# Altium schematic sheet MAIN.SchDoc
size A4; SheetNumber: 3; SheetTotal: 3
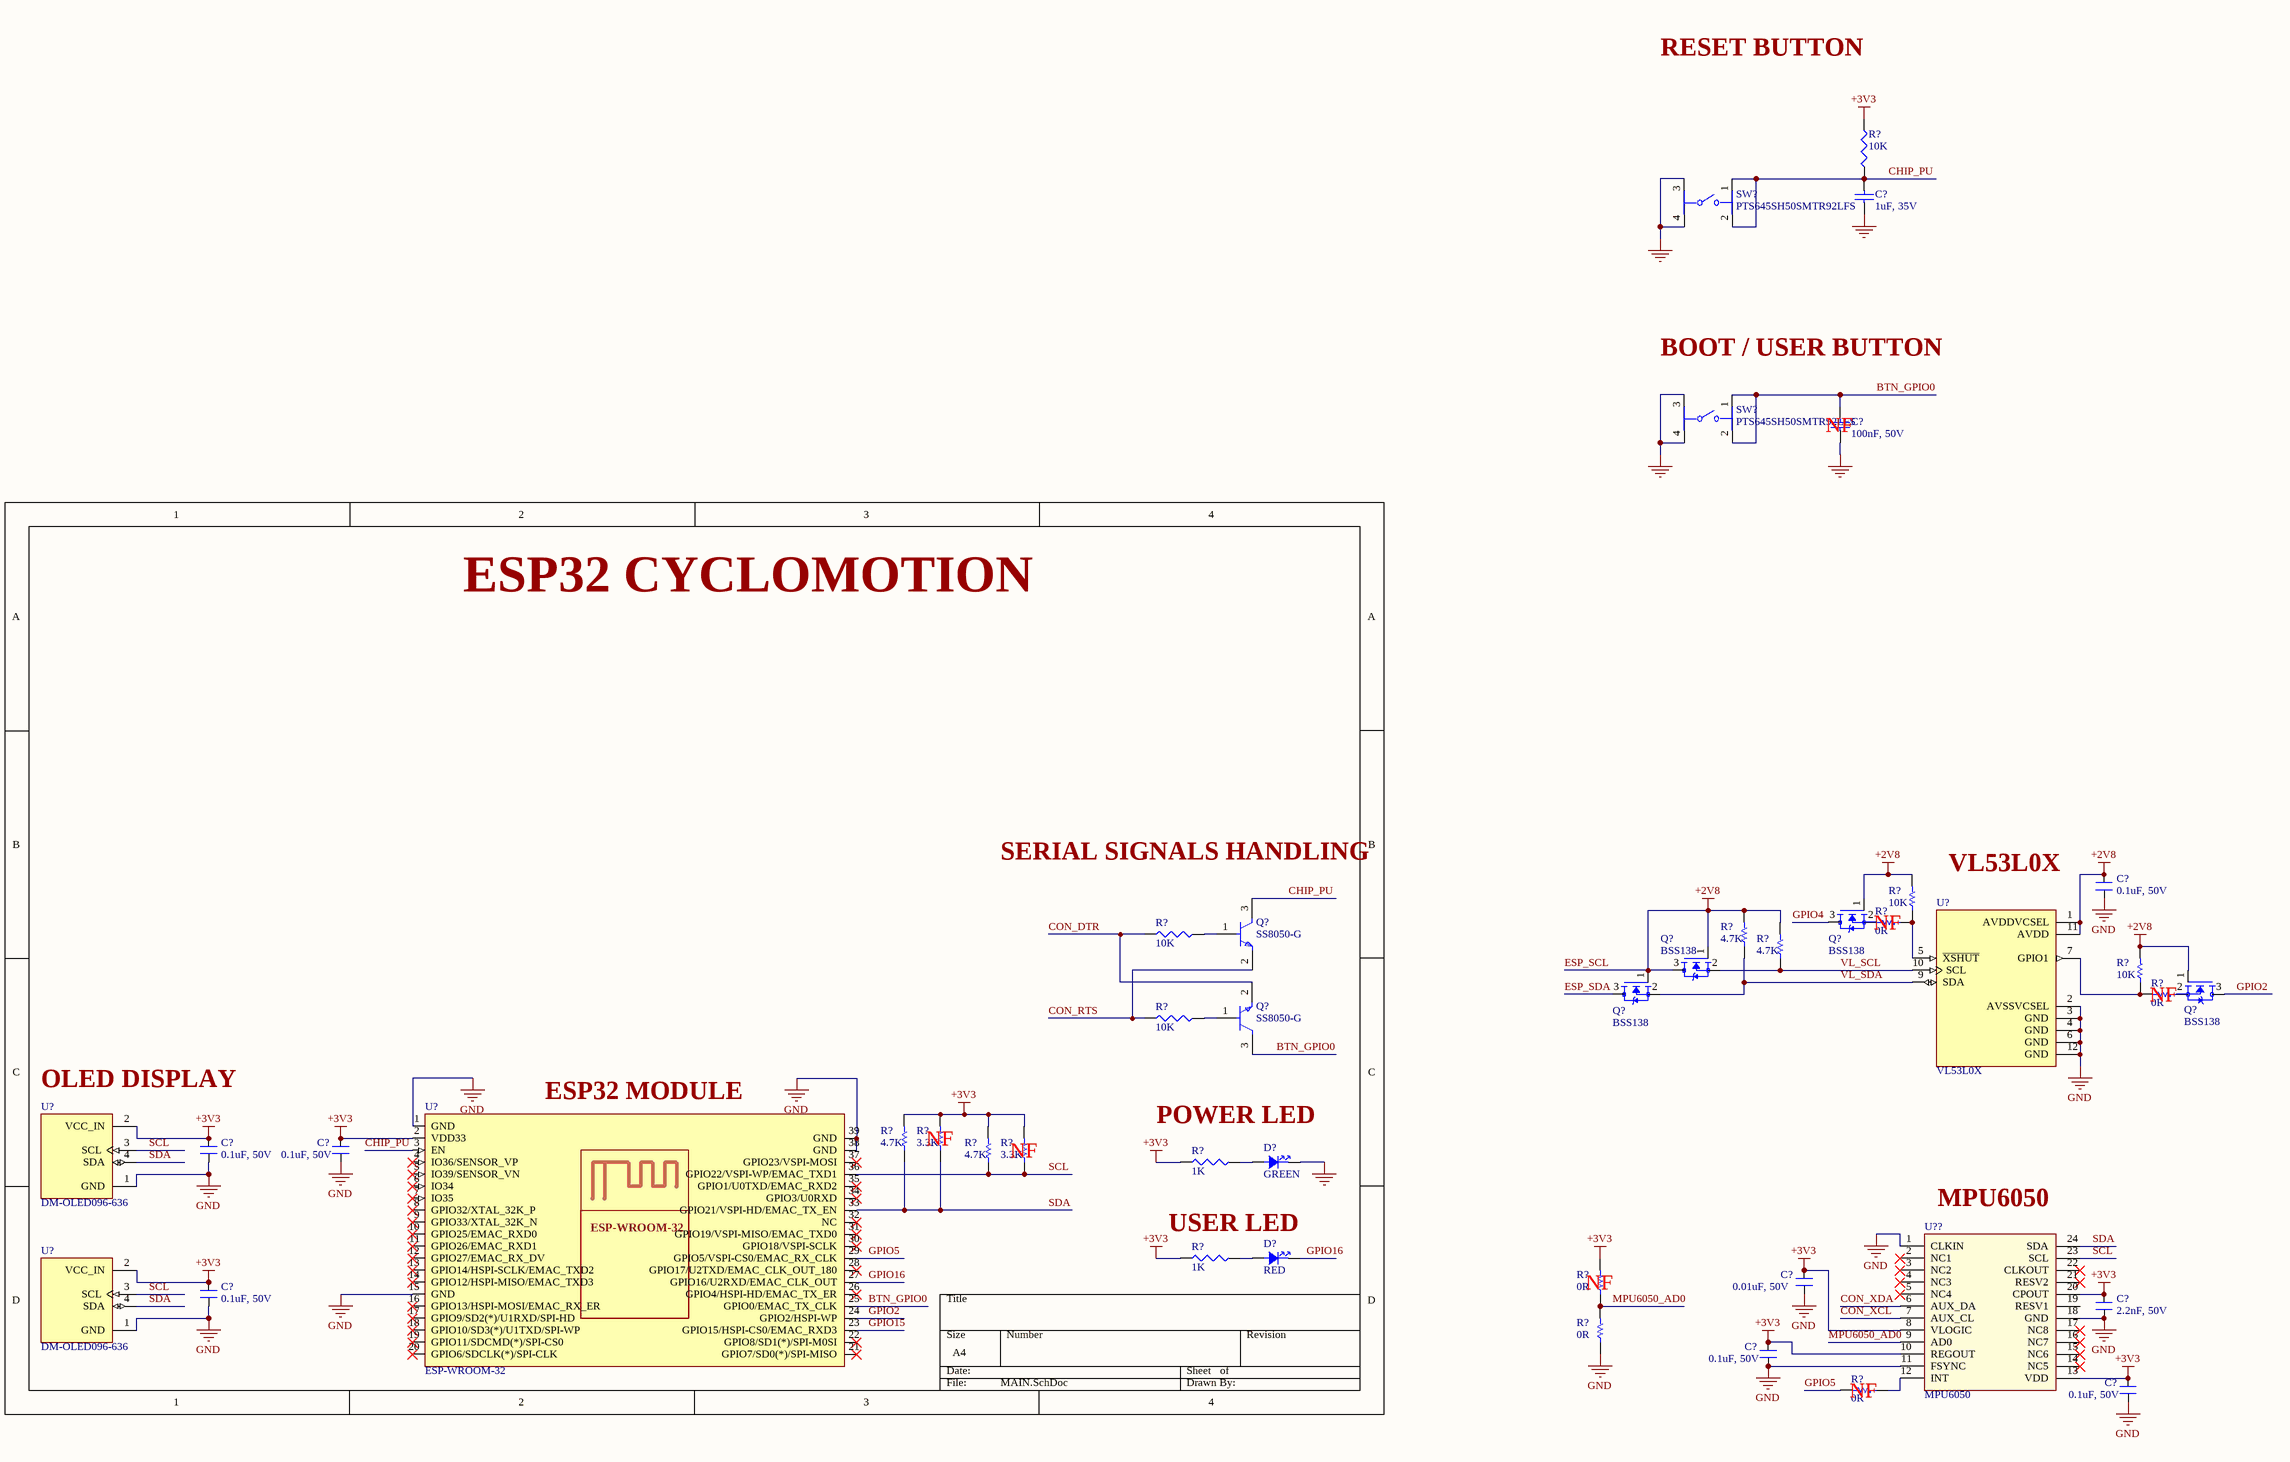
[diagram p0: MAIN.SchDoc]

## Parts
(Parts that share a designator on the sheet are numbered #1, #2 ... from top to bottom, then left to right.)
C?#1  1uF, 35V  [CAPC1005X55N]
C?#2  100nF, 50V  [CAPC1005X55N]
C?#3  0.1uF, 50V  [CAP_CERA_C2012(CC0805INCH)]
C?#4  0.1uF, 50V  [CAP_CERA_C2012(CC0805INCH)]
C?#5  0.1uF, 50V  [CAP_CERA_C2012(CC0805INCH)]
C?#6  0.01uF, 50V  [CAP_CERA_C2012(CC0805INCH)]
C?#7  0.1uF, 50V  [CAP_CERA_C2012(CC0805INCH)]
C?#8  2.2nF, 50V  [CAP_CERA_C2012(CC0805INCH)]
C?#9  0.1uF, 50V  [CAP_CERA_C2012(CC0805INCH)]
C?#10  0.1uF, 50V  [CAP_CERA_C2012(CC0805INCH)]
D?#1  GREEN  [LED0402G]
D?#2  RED  [LED0402R]
Q?#1  BSS138  [SOT95P240X111-3N]
Q?#2  SS8050-G  [FP-SS8050-G-IPC_B]
Q?#3  BSS138  [SOT95P240X111-3N]
Q?#4  BSS138  [SOT95P240X111-3N]
Q?#5  BSS138  [SOT95P240X111-3N]
Q?#6  SS8050-G  [FP-SS8050-G-IPC_B]
R?#1  10K  [RESC1005X37N]
R?#2  10K  [Res 1206 SMD]
R?#3  0R  [Res 1206 SMD]
R?#4  10K  [RESC1005X37N]
R?#5  4.7K  [Res 1206 SMD]
R?#6  4.7K  [Res 1206 SMD]
R?#7  10K  [Res 1206 SMD]
R?#8  0R  [Res 1206 SMD]
R?#9  10K  [RESC1005X37N]
R?#10  4.7K  [Res 1206 SMD]
R?#11  3.3K  [Res 1206 SMD]
R?#12  1K  [RESC1005X37N]
R?#13  4.7K  [Res 1206 SMD]
R?#14  3.3K  [Res 1206 SMD]
R?#15  1K  [RESC1005X37N]
R?#16  0R  [Res 1206 SMD]
R?#17  0R  [Res 1206 SMD]
R?#18  0R  [Res 1206 SMD]
SW?#1  PTS645SH50SMTR92LFS  [FP-PTS645SH50SMTR92LFS-MFG]
SW?#2  PTS645SH50SMTR92LFS  [FP-PTS645SH50SMTR92LFS-MFG]
U?#1  VL53L0X  [SENSOR_VL53L0X]
U?#2  ESP-WROOM-32  [ESP32 WROOM]
U?#3  DM-OLED096-636  [MODULE_DM-OLED096-636]
U?#4  DM-OLED096-636  [MODULE_DM-OLED096-636]
U??  MPU6050  [14# MPU -6050]

## Nets
+3V3: C?#4.1 C?#5.1 C?#6.1 C?#7.1 C?#8.1 C?#9.1 C?#10.1 R?#1.2 R?#10.2 R?#11.2 R?#12.2 R?#13.2 R?#14.2 R?#15.2 R?#16.2 U?#2.2(VDD33) U?#3.2(VCC_IN) U?#4.2(VCC_IN) U??.8(VLOGIC) U??.10(REGOUT) U??.13(VDD) U??.20(CPOUT)
ESP_SCL: C?#3.1 Q?#1.1(G) Q?#3.1(G) Q?#3.3(D) Q?#4.1(G) Q?#5.1(G) R?#2.2 R?#5.2 R?#6.2 R?#7.2 U?#1.1(AVDDVCSEL) U?#1.11(AVDD)  [also labelled +2V8]
GND: C?#1.1 C?#2.1 C?#3.2 C?#4.2 C?#5.2 C?#6.2 C?#7.2 C?#8.2 C?#9.2 C?#10.2 D?#1.1 R?#17.1 SW?#1.3 SW?#1.4 SW?#2.3 SW?#2.4 U?#1.2(AVSSVCSEL) U?#1.3(GND) U?#1.4(GND) U?#1.6(GND) U?#1.12(GND) U?#2.1(GND) U?#2.15(GND) U?#2.38(GND) U?#2.39(GND) U?#3.1(GND) U?#4.1(GND) U??.1(CLKIN) U??.11(FSYNC) U??.18(GND)
BTN_GPIO0: C?#2.2 Q?#6.3(C) SW?#2.1 SW?#2.2 U?#2.25(GPIO0/EMAC_TX_CLK)
CHIP_PU: C?#1.2 Q?#2.3(C) R?#1.1 SW?#1.1 SW?#1.2 U?#2.3(EN)
CON_DTR: Q?#6.2(E) R?#4.1
CON_RTS: Q?#2.2(E) R?#9.1
CON_XCL: U??.7(AUX_CL)
CON_XDA: U??.6(AUX_DA)
ESP_SDA: Q?#4.3(D)
GPIO2: Q?#5.3(D) U?#2.24(GPIO2/HSPI-WP)
GPIO4: Q?#1.3(D)
GPIO5: R?#18.2 U?#2.29(GPIO5/VSPI-CS0/EMAC_RX_CLK)
GPIO15: U?#2.23(GPIO15/HSPI-CS0/EMAC_RXD3)
GPIO16: D?#2.1 U?#2.27(GPIO16/U2RXD/EMAC_CLK_OUT)
MPU6050_AD0: R?#16.1 R?#17.2 U??.9(AD0)
SCL: R?#13.1 R?#14.1 U?#2.36(GPIO22/VSPI-WP/EMAC_TXD1) U?#3.3(SCL) U?#4.3(SCL) U??.23(SCL)
SDA: R?#10.1 R?#11.1 U?#2.33(GPIO21/VSPI-HD/EMAC_TX_EN) U?#3.4(SDA) U?#4.4(SDA) U??.24(SDA)
VL_SCL: Q?#3.2(S) R?#6.1 U?#1.10(SCL)
VL_SDA: Q?#4.2(S) R?#5.1 U?#1.9(SDA)
NetD?#1_2: D?#1.2 R?#12.1
NetD?#2_2: D?#2.2 R?#15.1
NetQ?#1_2: Q?#1.2(S) R?#3.2
NetQ?#2_1: Q?#2.1(B) R?#4.2
NetQ?#5_2: Q?#5.2(S) R?#8.1
NetQ?#6_1: Q?#6.1(B) R?#9.2
NetR?#2_1: R?#2.1 R?#3.1 U?#1.5(~{XSHUT})
NetR?#7_1: R?#7.1 R?#8.2 U?#1.7(GPIO1)
NetR?#18_1: R?#18.1 U??.12(INT)

Not connected (* = marked no-connect by the designer): U?#2 4(IO36/SENSOR_VP)* 5(IO39/SENSOR_VN)* 6(IO34)* 7(IO35)* 8(GPIO32/XTAL_32K_P)* 9(GPIO33/XTAL_32K_N)* 10(GPIO25/EMAC_RXD0)* 11(GPIO26/EMAC_RXD1)* 12(GPIO27/EMAC_RX_DV)* 13(GPIO14/HSPI-SCLK/EMAC_TXD2)* 14(GPIO12/HSPI-MISO/EMAC_TXD3)* 16(GPIO13/HSPI-MOSI/EMAC_RX_ER)* 17(GPIO9/SD2(*)/U1RXD/SPI-HD)* 18(GPIO10/SD3(*)/U1TXD/SPI-WP)* 19(GPIO11/SDCMD(*)/SPI-CS0)* 20(GPIO6/SDCLK(*)/SPI-CLK)* 21(GPIO7/SD0(*)/SPI-MISO)* 22(GPIO8/SD1(*)/SPI-M0SI)* 26(GPIO4/HSPI-HD/EMAC_TX_ER)* 28(GPIO17/U2TXD/EMAC_CLK_OUT_180)* 30(GPIO18/VSPI-SCLK)* 31(GPIO19/VSPI-MISO/EMAC_TXD0)* 32(NC)* 34(GPIO3/U0RXD)* 35(GPIO1/U0TXD/EMAC_RXD2)* 37(GPIO23/VSPI-MOSI)*; U?? 2(NC1)* 3(NC2)* 4(NC3)* 5(NC4)* 14(NC5)* 15(NC6)* 16(NC7)* 17(NC8)* 19(RESV1) 21(RESV2)* 22(CLKOUT)*

## Notes on the sheet
- RESET BUTTON
- BOOT / USER BUTTON
- (near C?#2) NF
- ESP32 CYCLOMOTION
- SERIAL SIGNALS HANDLING
- VL53L0X
- (near R?#3) NF
- (near R?#8) NF
- (near U?#3) OLED DISPLAY
- (near U?#2) ESP32 MODULE
- (near R?#11) NF
- POWER LED
- (near R?#14) NF
- (near U??) MPU6050
- USER LED
- (near R?#16) NF
- (near R?#18) NF

## Library data of the parts
C?#1 = CL05A105KL5NRNC: CAP CER 1UF 35V X5R 0402; Manufacturer: Samsung; Dielectric Material: Ceramic; Multilayer: Yes; Tolerance  (fill in as +-): 10%; Supplier: Digikey; Supplier Part Number: 1276-6796-1-ND; Manufacturer Part Number: CL05A105KL5NRNC; RoHS: Yes; Category: Ceramic Capacitors; Stock: 469958; Pricing: 1=0.33, 10=0.212, 50=0.149, 100=0.1202, 500=0.08934, 1000=0.07818, 2500=0.07446, 5000=0.06887 (USD); Mounting Technology: Surface Mount; Pins: 2; Package Shape: Rectangular; Case/Package: 0402; Terminal Finish: Nickel; Min Operating Temperature: -55°C; Max Operating Temperature: 85°C; JESD-609 Code: e3; Value: 1uF; Capacitor Type: Ceramic; Packaging: Tape and Reel; Tolerance (fill in as +-): 10%; Rated DC Voltage (URdc): 35V; Temperature Characteristics Code: X5R; Termination: Wraparound; Reach SVHC Compliant: Yes; RoHS Compliant: Yes; ComponentLink1URL: https://datasheet.ciiva.com:443/pdfs/VipMasterIC/IC/SEMS/SEMS-S-A0008384515/SEMS-S-A0008872905-1.pdf?src-supplier=IHS+Markit; ComponentLink1Description: https://datasheet.ciiva.com:443/pdfs/VipMasterIC/IC/SEMS/SEMS-S-A0008384515/SEMS-S-A0008872905-1.pdf?src-supplier=IHS+Markit; ComponentLink2URL: http://www.samsungsem.com/kr/support/product-search/mlcc/CL05A105KL5NRNC.jsp?src-supplier=Digikey; ComponentLink2Description: http://www.samsungsem.com/kr/support/product-search/mlcc/CL05A105KL5NRNC.jsp?src-supplier=Digikey; LCSC Part Number: C307413
C?#2 = CL05B104KB54PNC: CAP CER 0.1UF 50V X7R 0402; Manufacturer: Samsung; Dielectric Material: Ceramic; Supplier: Digikey; Supplier Part Number: 1276-CL05B104KB54PNCCT-ND; Manufacturer Part Number: CL05B104KB54PNC; RoHS: Yes; Category: Ceramic Capacitors; Stock: 1237875; Pricing: 1=0.1, 10=0.044, 50=0.025, 100=0.0194, 500=0.0146, 1000=0.01147, 2500=0.01043, 5000=0.00959 (USD); Pins: 2; Capacitor Type: Ceramic; RoHS Compliant: Yes; Reach SVHC Compliant: Yes; ComponentLink1URL: https://datasheet.ciiva.com:443/pdfs/VipMasterIC/IC/SEMS/SEMS-S-A0006318249/SEMS-S-A0006320959-1.pdf?src-supplier=IHS+Markit; ComponentLink1Description: https://datasheet.ciiva.com:443/pdfs/VipMasterIC/IC/SEMS/SEMS-S-A0006318249/SEMS-S-A0006320959-1.pdf?src-supplier=IHS+Markit; ComponentLink2URL: https://datasheet.octopart.com/CL05B104KB54PNC-Samsung-datasheet-8326407.pdf?src-supplier=TME; ComponentLink2Description: https://datasheet.octopart.com/CL05B104KB54PNC-Samsung-datasheet-8326407.pdf?src-supplier=TME; LCSC Part Number: C307331
C?#3-C?#10 = CAP CERA 0805: CERAMIC CAP 0805; Value: 100pF, 2012
D?#1 = VLMG1500-GS08: LED YLW-GRN 0402 SMD; Manufacturer: Vishay; Color: Green,Yellow; Lens Color: Clear; Viewing Angle: 130°; Forward Current: 30mA; Forward Voltage: 2V; Luminous Intensity: 35mcd; Dominant Wavelength: 571nm; Test Current: 20mA; Number of Elements: 1; Power Dissipation: 75mW; Lens Style: Rectangular; Reverse Voltage: 5V; Supplier: Digikey; Supplier Part Number: VLMG1500-GS08CT-ND; Manufacturer Part Number: VLMG1500-GS08; RoHS: Yes; Category: LEDs; Stock: 98; Pricing: 1=0.34, 10=0.265, 100=0.119, 500=0.10746, 1000=0.08827 (USD); Mounting Technology: Surface Mount; Case/Package: 0402; Pins: 2; Case Code (Metric): 1005; Case Code (Imperial): 0402; Min Operating Temperature: -30°C; Max Operating Temperature: 85°C; Package Quantity: 1; Packaging: Tape and Reel; Illumination Color: Green; Wavelength: 571nm; Number of LEDs: 1; Power Rating: 75mW; Series: CHipLED; Length: 1mm; Width: 0.5mm; Height: 0.35mm; Depth: 0.5mm; Radiation Hardening: No; Lead Free: Lead Free; RoHS Compliant: Yes; Reach SVHC Compliant: Unknown; ComponentLink1URL: https://datasheet.ciiva.com/12071/vlmo1500-244705-12071911.pdf?src-supplier=Mouser; ComponentLink1Description: https://datasheet.ciiva.com/12071/vlmo1500-244705-12071911.pdf?src-supplier=Mouser; ComponentLink2URL: https://datasheet.ciiva.com/30005/vlmo1500-30005134.pdf?src-supplier=Avnet; ComponentLink2Description: https://datasheet.ciiva.com/30005/vlmo1500-30005134.pdf?src-supplier=Avnet; LCSC Part Number: C511404
D?#2 = VLMS1500-GS08: LED RED 0402 SMD; Manufacturer: Vishay; Shape: Rectangular; Forward Current: 30mA; Forward Voltage: 2.4V; Luminous Intensity-Nom: 54mcd; Channels: 1; Optoelectronic Device Type: SINGLE COLOR LED; Reverse Voltage-Max: 5V; Viewing Angle: 130°; Overall Height: 0.35mm; Supplier: Digikey; Supplier Part Number: VLMS1500-GS08CT-ND; Manufacturer Part Number: VLMS1500-GS08; RoHS: Yes; Category: LEDs; Stock: 70376; Pricing: 1=0.34, 10=0.265, 100=0.119, 500=0.10746, 1000=0.08827 (USD); Mounting Technology: Surface Mount; Pins: 2; Color: Red; Color@wavelength: Red; Min Operating Temperature: -30°C; Max Operating Temperature: 85°C; Packaging: Tape and Reel; Size: 0.5mm; Terminal Pitch: 0.95mm; Reach SVHC Compliant: Yes; RoHS Compliant: Yes; ComponentLink1URL: https://datasheet.ciiva.com:443/pdfs/VipMasterIC/IC/VISH/VISH-S-A0003457490/VISH-S-A0003457490-1.pdf?src-supplier=IHS+Markit; ComponentLink1Description: https://datasheet.ciiva.com:443/pdfs/VipMasterIC/IC/VISH/VISH-S-A0003457490/VISH-S-A0003457490-1.pdf?src-supplier=IHS+Markit; ComponentLink2URL: http://www.farnell.com/datasheets/1809983.pdf?src-supplier=Farnell; ComponentLink2Description: http://www.farnell.com/datasheets/1809983.pdf?src-supplier=Farnell; ComponentLink3URL: http://www.mouser.com/ds/2/427/vlmo1500-244705.pdf?src-supplier=Mouser; ComponentLink3Description: http://www.mouser.com/ds/2/427/vlmo1500-244705.pdf?src-supplier=Mouser; ComponentLink4URL: https://datasheet.octopart.com/VLMS1500-GS08-Vishay-datasheet-62332426.pdf?src-supplier=Newark; ComponentLink4Description: https://datasheet.octopart.com/VLMS1500-GS08-Vishay-datasheet-62332426.pdf?src-supplier=Newark; ComponentLink5URL: https://datasheet.octopart.com/VLMS1500-GS08-Vishay-datasheet-33014519.pdf?src-supplier=Element14; ComponentLink5Description: https://datasheet.octopart.com/VLMS1500-GS08-Vishay-datasheet-33014519.pdf?src-supplier=Element14; ComponentLink6URL: http://datasheet.octopart.com/VLMS1500-GS08-Vishay-datasheet-21227148.pdf?src-supplier=Avnet; ComponentLink6Description: http://datasheet.octopart.com/VLMS1500-GS08-Vishay-datasheet-21227148.pdf?src-supplier=Avnet; ComponentLink7URL: http://www.farnell.com/datasheets/1809983.pdf?src-supplier=Newark; ComponentLink7Description: http://www.farnell.com/datasheets/1809983.pdf?src-supplier=Newark; ComponentLink8URL: http://www.farnell.com/datasheets/2050839.pdf?src-supplier=Newark; ComponentLink8Description: http://www.farnell.com/datasheets/2050839.pdf?src-supplier=Newark; ComponentLink9URL: http://datasheet.octopart.com/VLMS1500-GS08-Vishay-datasheet-21227148.pdf?src-supplier=Quest; ComponentLink9Description: http://datasheet.octopart.com/VLMS1500-GS08-Vishay-datasheet-21227148.pdf?src-supplier=Quest; ComponentLink10URL: http://datasheet.octopart.com/VLMS1500-GS08-Vishay-datasheet-21227148.pdf?src-supplier=NAC+Semi; ComponentLink10Description: http://datasheet.octopart.com/VLMS1500-GS08-Vishay-datasheet-21227148.pdf?src-supplier=NAC+Semi; LCSC Part Number: C511370
Q?#1 Q?#3-Q?#5 = BSS138: N-Channel 50 V 220mA (Ta) 350mW (Ta) Surface Mount SOT-23-3
Q?#2 Q?#6 = SS8050-G: TRANS NPN 25V 1.5A SOT23-3; Manufacturer: Comchip; Supplier: Digikey; Supplier Part Number: 641-1790-1-ND; Manufacturer Part Number: SS8050-G; RoHS: Yes; Category: Transistors; Stock: 108568; Pricing: 1=0.29, 10=0.2, 100=0.0978, 500=0.08154, 1000=0.05666 (USD); Reach SVHC Compliant: Yes; RoHS Compliant: Yes; ComponentLink1URL: https://datasheet.ciiva.com:443/pdfs/VipMasterIC/IC/COMC/COMC-S-A0004994192/COMC-S-A0004994192-1.pdf?src-supplier=IHS+Markit; ComponentLink1Description: https://datasheet.ciiva.com:443/pdfs/VipMasterIC/IC/COMC/COMC-S-A0004994192/COMC-S-A0004994192-1.pdf?src-supplier=IHS+Markit; ComponentLink2URL: http://www.comchiptech.com/admin/files/product/SS8050-G RevA181526.pdf?src-supplier=Digikey; ComponentLink2Description: http://www.comchiptech.com/admin/files/product/SS8050-G RevA181526.pdf?src-supplier=Digikey; LCSC Part Number: C164886
R?#1 R?#4 R?#9 = AC0402FR-0710KL: RES SMD 10K OHM 1% 1/16W 0402; Manufacturer: Yageo; Additional Feature: LASER TRIMMABLE; Power: 62.5mW; Rated Temperature: 70°C; Value: 10kR; Temperature Coefficient: 100ppm/°C; Working Voltage: 50V; Package Height: 0.32mm; Package Length: 1mm; Package Width: 0.5mm; Reference Standard: AEC-Q200; Supplier: Digikey; Supplier Part Number: YAG3436CT-ND; Manufacturer Part Number: AC0402FR-0710KL; RoHS: Yes; Category: Chip SMD Resistors; Stock: 1122213; Pricing: 1=0.1, 10=0.019, 50=0.0116, 100=0.0095, 500=0.00638, 1000=0.00544, 5000=0.00391 (USD); Mounting Technology: Surface Mount; Pins: 2; Package Shape: Rectangular; Case/Package: 0402; Terminal Finish: Nickel; Min Operating Temperature: -55°C; Max Operating Temperature: 155°C; Tolerance: 1%; JESD-609 Code: e3; Resistor Type: FIXED RESISTOR; Construction: Chip; Package Style: SMTMeter; Packaging: Tape and Reel; Technology: METAL GLAZE/THICK FILM; Termination: Wraparound; Reach SVHC Compliant: Yes; RoHS Compliant: Yes; ComponentLink1URL: https://datasheet.ciiva.com:443/pdfs/VipMasterIC/IC/YAGO/YAGO-S-A0003597364/YAGO-S-A0003597364-1.pdf?src-supplier=IHS+Markit; ComponentLink1Description: https://datasheet.ciiva.com:443/pdfs/VipMasterIC/IC/YAGO/YAGO-S-A0003597364/YAGO-S-A0003597364-1.pdf?src-supplier=IHS+Markit; ComponentLink2URL: https://datasheet.ciiva.com/12656/pyu-ac-51-rohs-l-2-12656634.pdf?src-supplier=Mouser; ComponentLink2Description: https://datasheet.ciiva.com/12656/pyu-ac-51-rohs-l-2-12656634.pdf?src-supplier=Mouser; LCSC Part Number: C144807
R?#2 R?#3 R?#5-R?#8 R?#10 R?#11 R?#13 R?#14 R?#16-R?#18 = RES-1206: RES SMD 10K OHM 1% 1206; Manufacturer: Yageo; Manufacturer Part Number: RC1206FR-075R1L; Resistance (Ohms): 5.1; Power (Watts): 0.25W, 1/4W; Temperature Coefficient: ±200ppm/°C; Supplier 1: Digi-Key; RoHS: RoHS Compliant; Category: Resistors; Stock 1: 96701; Pricing 1: 1=0.1, 10=0.051, 100=0.0207, 1000=0.0093, 2500=0.00807 (USD); Packaging: Cut Tape (CT); Part Status: Active; Tolerance: ±1%; Composition: Thick Film; Features: Moisture Resistant; Operating Temperature: -55°C ~ 155°C; Package / Case: 1206 (3216 Metric); Supplier Device Package: 1206; Size / Dimension: 0.122" L x 0.063" W (3.10mm x 1.60mm); Height - Seated (Max): 0.026" (0.65mm); Failure Rate: -; ComponentLink1URL: http://www.yageo.com/documents/recent/PYu-RC_Group_51_RoHS_L_7.pdf; ComponentLink1Description: http://www.yageo.com/documents/recent/PYu-RC_Group_51_RoHS_L_7.pdf; Supplier Part Number 1: 311-5.10FRCT-ND
R?#12 R?#15 = RC0402FR-071KL: RES 1K OHM 1% 1/16W 0402; Manufacturer: Yageo; Additional Feature: LASER TRIMMABLE; Power: 62.5mW; Rated Temperature: 70°C; Value: 1kR; Temperature Coefficient: 100ppm/°C; Working Voltage: 50V; Package Height: 0.35mm; Package Length: 1mm; Package Width: 0.5mm; Supplier: Digikey; Supplier Part Number: 311-1.00KLRCT-ND; Manufacturer Part Number: RC0402FR-071KL; RoHS: Yes; Category: Chip SMD Resistors; Stock: 11967525; Pricing: 1=0.1, 10=0.015, 50=0.0088, 100=0.0073, 500=0.00488, 1000=0.00417, 5000=0.00297 (USD); Mounting Technology: Surface Mount; Pins: 2; Package Shape: Rectangular; Case/Package: 0402; Terminal Finish: Nickel; Min Operating Temperature: -55°C; Max Operating Temperature: 155°C; Tolerance: 1%; JESD-609 Code: e3; Resistor Type: FIXED RESISTOR; Construction: Chip; Package Style: SMTMeter; Packaging: Tape and Reel; Technology: METAL GLAZE/THICK FILM; Termination: Wraparound; Reach SVHC Compliant: Yes; RoHS Compliant: Yes; ComponentLink1URL: https://datasheet.ciiva.com:443/pdfs/VipMasterIC/IC/YAGO/YAGO-S-A0008145938/YAGO-S-A0008145938-1.pdf?src-supplier=IHS+Markit; ComponentLink1Description: https://datasheet.ciiva.com:443/pdfs/VipMasterIC/IC/YAGO/YAGO-S-A0008145938/YAGO-S-A0008145938-1.pdf?src-supplier=IHS+Markit; ComponentLink2URL: https://datasheet.ciiva.com/11819/0900766b80c66297-11819477.pdf?src-supplier=Rs; ComponentLink2Description: https://datasheet.ciiva.com/11819/0900766b80c66297-11819477.pdf?src-supplier=Rs; ComponentLink3URL: https://datasheet.ciiva.com/22747/1018594-22747513.pdf?src-supplier=Element14; ComponentLink3Description: https://datasheet.ciiva.com/22747/1018594-22747513.pdf?src-supplier=Element14; ComponentLink4URL: https://datasheet.ciiva.com/12666/pyu-rc0402-51-rohs-l-6-r-12666741.pdf?src-supplier=Mouser; ComponentLink4Description: https://datasheet.ciiva.com/12666/pyu-rc0402-51-rohs-l-6-r-12666741.pdf?src-supplier=Mouser; ComponentLink5URL: https://datasheet.ciiva.com/17063/pyu-rc0402-51-rohs-l-6-r-17063193.pdf?src-supplier=Future+Electronics; ComponentLink5Description: https://datasheet.ciiva.com/17063/pyu-rc0402-51-rohs-l-6-r-17063193.pdf?src-supplier=Future+Electronics; ComponentLink6URL: https://datasheet.ciiva.com/7983/1018594-7983502.pdf?src-supplier=Element14; ComponentLink6Description: https://datasheet.ciiva.com/7983/1018594-7983502.pdf?src-supplier=Element14; ComponentLink7URL: https://datasheet.ciiva.com/7849/1018594-7849869.pdf?src-supplier=Element14; ComponentLink7Description: https://datasheet.ciiva.com/7849/1018594-7849869.pdf?src-supplier=Element14; ComponentLink8URL: https://datasheet.ciiva.com/7849/1018594-7849871.pdf?src-supplier=Element14; ComponentLink8Description: https://datasheet.ciiva.com/7849/1018594-7849871.pdf?src-supplier=Element14; LCSC Part Number: C106235
SW?#1 SW?#2 = PTS645SH50SMTR92LFS: SWITCH TACTILE SPST-NO 0.05A 12V; Manufacturer: ITT C&K; Manufacturer Series: PTS645; Actuator Type: Pushbutton; Contact Current(DC)-Max: 50mA; Contact DC Max Rating R Load: 0.05A@12VDC; Contact Resistance: 0.1mR; Dielectric Withstand Volts: 250VACV; Electrical Life: 100000Cycles; Insulation Resistance: 100GR; PCB Hole Count: 4; Switch Action: MOMENTARY; Switch Function: SPST; Switch Type: Keypad; Body Breadth: 5.9944inch; Body Height: 3.4544mm; Body Length or Diameter: 5.9944mm; Supplier: Digikey; Supplier Part Number: CKN9085CT-ND; Manufacturer Part Number: PTS645SH50SMTR92LFS; RoHS: Yes; Category: Tactile Switches; Stock: 64637; Pricing: 1=0.35, 10=0.337, 25=0.3172, 100=0.2753, 250=0.24972, 500=0.2323 (USD); Mounting Technology: Surface Mount; Terminal Finish: Silver; Min Operating Temperature: -20°C; Max Operating Temperature: 60°C; JESD-609 Code: e4; Contact Voltage(DC)-Max: 12V; Termination: Solder; Terminal Length: 0.138inch; Reach SVHC Compliant: Yes; RoHS Compliant: Yes; ComponentLink1URL: https://datasheet.ciiva.com:443/pdfs/VipMasterIC/IC/CKCI/CKCI-S-A0001796527/CKCI-S-A0001796842-1.pdf?src-supplier=IHS+Markit; ComponentLink1Description: https://datasheet.ciiva.com:443/pdfs/VipMasterIC/IC/CKCI/CKCI-S-A0001796527/CKCI-S-A0001796842-1.pdf?src-supplier=IHS+Markit; ComponentLink2URL: https://datasheet.ciiva.com/29903/getdatasheetpartid-773702-29903807.pdf?src-supplier=Verical; ComponentLink2Description: https://datasheet.ciiva.com/29903/getdatasheetpartid-773702-29903807.pdf?src-supplier=Verical; ComponentLink3URL: https://datasheet.ciiva.com/14920/pts645-14920741.pdf?src-supplier=Digikey; ComponentLink3Description: https://datasheet.ciiva.com/14920/pts645-14920741.pdf?src-supplier=Digikey; ComponentLink4URL: https://datasheet.ciiva.com/22637/1707731-22637356.pdf?src-supplier=Element14; ComponentLink4Description: https://datasheet.ciiva.com/22637/1707731-22637356.pdf?src-supplier=Element14; LCSC Part Number: C221869
U?#1 = VL53L0X: VL53L0X - Light, 3D Time-of-Flight _ToF_ Sensor Evaluation Board; MF: STMicroelectronics; MP: VL53L0X; Package: None; Price: None; Availability: Unavailable; SnapEDA_Link: https://www.snapeda.com/parts/VL53L0X/STMicroelectronics/view-part/473967/?ref=snap; Value: *
U?#3 U?#4 = DM-OLED096-636: 0.96â€ 128 X 64 MONOCHROME GRAPHIC OLED DISPLAY MODULE - I2C; SnapEDA_Link: https://www.snapeda.com/parts/DM-OLED096-636/Display+Module/view-part/?ref=snap; Package: Package; Value: *; MF: Display Module; MP: DM-OLED096-636; Check_prices: https://www.snapeda.com/parts/DM-OLED096-636/Display+Module/view-part/?ref=eda
U?? = MPU6050: Case/Package: QFN; Supplier 1: RSComponents